# Altium schematic sheet LPCB220 - PUSHER INTERLOCK.SchDoc
size A3; Address1: Factory 10; Address2: 9-13 Dingley Avenue, Dandeong, VICTORIA 3175, AUSTRALIA; DocumentNumber: 13; Revision: 1; SheetNumber: 13; SheetTotal: 18; Lockie__PCB_SUB_ASSEMBLY: Pusher Interlock System; Lockie__PCB_ASSEMBLY: Brake Control; Lockie__LDL: LPCB220; Lockie__PCB_DESCRIPTION: Redundant Stepper Node
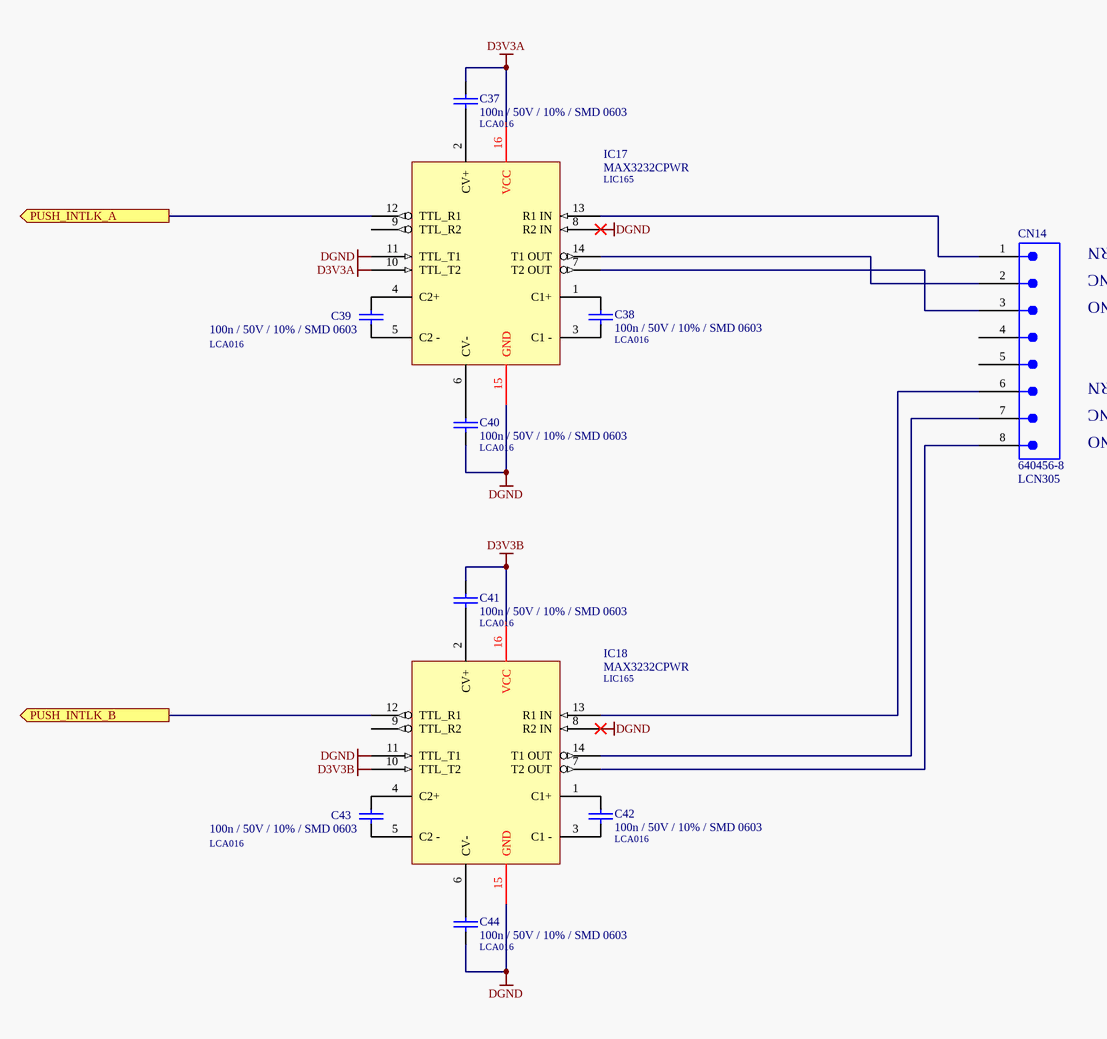
[diagram p0: LPCB220 - PUSHER INTERLOCK.SchDoc]

## Parts
C37  100n / 50V / 10% / SMD 0603  LDL_NUMBER: LCA016  [LFP011__CC1608-0603-IPC7351_B]
C38  100n / 50V / 10% / SMD 0603  LDL_NUMBER: LCA016  [LFP011__CC1608-0603-IPC7351_B]
C39  100n / 50V / 10% / SMD 0603  LDL_NUMBER: LCA016  [LFP011__CC1608-0603-IPC7351_B]
C40  100n / 50V / 10% / SMD 0603  LDL_NUMBER: LCA016  [LFP011__CC1608-0603-IPC7351_B]
C41  100n / 50V / 10% / SMD 0603  LDL_NUMBER: LCA016  [LFP011__CC1608-0603-IPC7351_B]
C42  100n / 50V / 10% / SMD 0603  LDL_NUMBER: LCA016  [LFP011__CC1608-0603-IPC7351_B]
C43  100n / 50V / 10% / SMD 0603  LDL_NUMBER: LCA016  [LFP011__CC1608-0603-IPC7351_B]
C44  100n / 50V / 10% / SMD 0603  LDL_NUMBER: LCA016  [LFP011__CC1608-0603-IPC7351_B]
CN14  640456-8  LDL_NUMBER: LCN305  [640456-8]
IC17  MAX3232CPWR  LDL_NUMBER: LIC165  [LFP049__TSSOP-16]
IC18  MAX3232CPWR  LDL_NUMBER: LIC165  [LFP049__TSSOP-16]

## Ports
PUSH_INTLK_A (out), PUSH_INTLK_B (out)

## Nets
D3V3A: C37.1 IC17.10(TTL_T2) IC17.16(VCC)
D3V3B: C41.1 IC18.10(TTL_T2) IC18.16(VCC)
DGND: C40.2 C44.2 IC17.8(R2_IN) IC17.11(TTL_T1) IC17.15(GND) IC18.8(R2_IN) IC18.11(TTL_T1) IC18.15(GND)
PUSH_INTLK_A: IC17.12(TTL_R1) ; port PUSH_INTLK_A
PUSH_INTLK_B: IC18.12(TTL_R1) ; port PUSH_INTLK_B
NetC37_2: C37.2 IC17.2(CV+)
NetC38_1: C38.1 IC17.1(C1+)
NetC38_2: C38.2 IC17.3(C1_-)
NetC39_1: C39.1 IC17.4(C2+)
NetC39_2: C39.2 IC17.5(C2_-)
NetC40_1: C40.1 IC17.6(CV-)
NetC41_2: C41.2 IC18.2(CV+)
NetC42_1: C42.1 IC18.1(C1+)
NetC42_2: C42.2 IC18.3(C1_-)
NetC43_1: C43.1 IC18.4(C2+)
NetC43_2: C43.2 IC18.5(C2_-)
NetC44_1: C44.1 IC18.6(CV-)
NetCN14_1: CN14.1 IC17.13(R1_IN)
NetCN14_2: CN14.2 IC17.14(T1_OUT)
NetCN14_3: CN14.3 IC17.7(T2_OUT)
NetCN14_6: CN14.6 IC18.13(R1_IN)
NetCN14_7: CN14.7 IC18.14(T1_OUT)
NetCN14_8: CN14.8 IC18.7(T2_OUT)

Not connected (* = marked no-connect by the designer): CN14 4 5; IC17 9(TTL_R2); IC18 9(TTL_R2)

## Notes on the sheet
- SW RETURN
- SW NO
- SW NC
- PCB COMPONENT DESCRIPTION
- LDL NUMBER
- Assembly Details
- Size
- Drawing File Name
- Revision
- http://rloop.org
- Scale
- A3
- Sheet Details
- N.T.S
- Sheet:
- Of:

## Library data of the parts
C37-C44 = 100n / 50V / 10% / SMD 0603: Capacitor, Ceramic Chip, 100nF, 50V, 10%, SMD 0603; FMEDA__OPERATING__VOLTAGE_MIN: 0; FMEDA__OPERATING__VOLTAGE_MAX: 3.3; FMEDA__OPERATING__TEMP_MIN: -20; FMEDA__OPERATING__TEMP_TYP: 27; FMEDA__OPERATING__TEMP_MAX: 50; FMEDA__CHANNEL: COM; Value: 100n; FMEDA__FUNCTION_IN_SYSTEM: *; FMEDA__OPERATING__VOLTAGE_TYP: 3.3
CN14 = 640456-8: Connector, Male Header, 8 Way; FMEDA__CHANNEL: COM; FMEDA__OPERATING__CURRENT_MAX: 0; FMEDA__OPERATING__TEMP_MAX: 50; FMEDA__OPERATING__TEMP_MIN: -20; FMEDA__OPERATING__TEMP_TYP: 27; FMEDA__OPERATING__VOLTAGE_MAX: 16; FMEDA__OPERATING__VOLTAGE_TYP: 12; FMEDA__FUNCTION_IN_SYSTEM: *; FMEDA__OPERATING__CURRENT_MIN: 0; FMEDA__OPERATING__CURRENT_TYP: 0; FMEDA__OPERATING__VOLTAGE_MIN: 0
IC17 IC18 = MAX3232CPWR: IC, RS232 Line Driver, 3.3V, SMD TSSOP16; FMEDA__OPERATING__TEMP_MAX: 50; FMEDA__OPERATING__TEMP_MIN: -20; FMEDA__OPERATING__TEMP_TYP: 27; FMEDA__CHANNEL: COM; FMEDA__OPERATING__VOLTAGE_MAX: 3.3; FMEDA__OPERATING__VOLTAGE_MIN: 0; FMEDA__FUNCTION_IN_SYSTEM: *; FMEDA__OPERATING__VOLTAGE_TYP: 3.3